# EAGLE design 40h_thru (EAGLE 4.15)
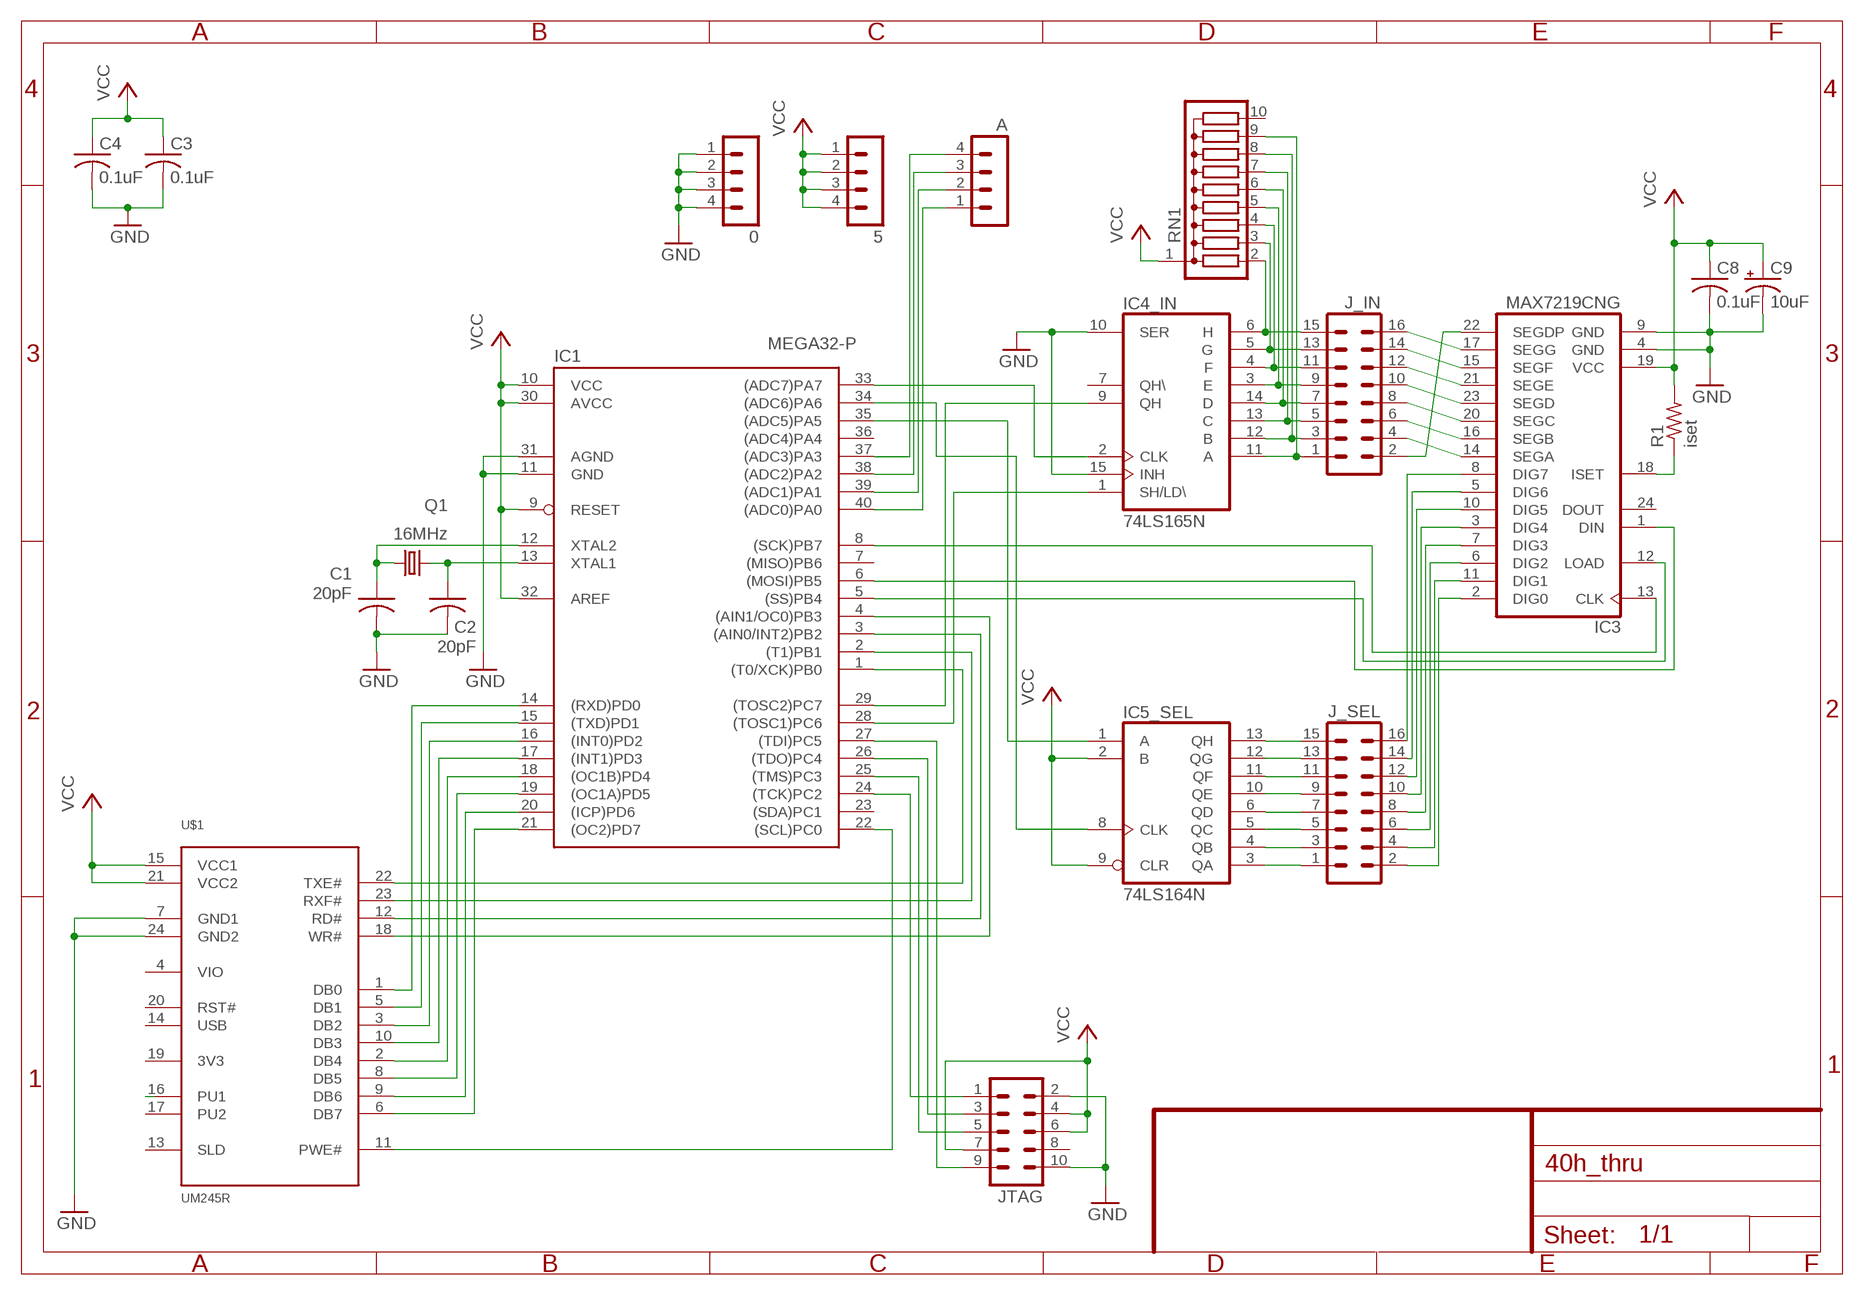
[diagram p0: schematic, sheet 1]

## Parts
0  MA04-1  [MA04-1]
5  MA04-1  [MA04-1]
A  MA04-1  [MA04-1]
C1  20pF  C-US050-025X075  [C050-025X075]
C2  20pF  C-US050-025X075  [C050-025X075]
C3  0.1uF  C-US050-025X075  [C050-025X075]
C4  0.1uF  C-US050-025X075  [C050-025X075]
C8  0.1uF  C-US050-025X075  [C050-025X075]
C9  10uF  CPOL-USTT2D4  [TT2D4]
IC1  MEGA32-P  [DIL40]
IC3  MAX7219CNG  [DIL24-3]
IC4_IN  74LS165N  [DIL16]
IC5_SEL  74LS164N  [DIL14]
J_IN  MA08-2  [MA08-2]
J_SEL  MA08-2  [MA08-2]
JTAG  MA05-2  [MA05-2]
Q1  16MHz  CRYTALHC49S  [HC49/S]
R1  iset  R-US_0207/7  [0207/7]
RN1  G09R  [SIL10]
U$1  UM245R  [DIL24]

## Nets
GND: 0.1 0.2 0.3 0.4 C1.2 C2.2 C3.2 C4.2 C8.2 C9.- IC1.11(GND) IC1.31(AGND) IC3.4(GND) IC3.9(GND) IC4_IN.10(SER) IC4_IN.15(INH) JTAG.2 JTAG.10 U$1.7(GND1) U$1.24(GND2)
MOSI: IC1.6((MOSI)PB5) IC3.1(DIN)
N$1: IC1.14((RXD)PD0) U$1.1(DB0)
N$2: C1.1 IC1.12(XTAL2) Q1.1
N$3: C2.1 IC1.13(XTAL1) Q1.2
N$4: IC1.15((TXD)PD1) U$1.5(DB1)
N$5: IC1.16((INT0)PD2) U$1.3(DB2)
N$6: IC1.17((INT1)PD3) U$1.10(DB3)
N$7: IC1.18((OC1B)PD4) U$1.2(DB4)
N$8: IC1.19((OC1A)PD5) U$1.8(DB5)
N$9: IC4_IN.6(H) J_IN.15 RN1.2
N$10: IC4_IN.5(G) J_IN.13 RN1.3
N$11: IC4_IN.4(F) J_IN.11 RN1.4
N$12: IC4_IN.3(E) J_IN.9 RN1.5
N$13: IC4_IN.14(D) J_IN.7 RN1.6
N$14: IC4_IN.13(C) J_IN.5 RN1.7
N$15: IC4_IN.12(B) J_IN.3 RN1.8
N$16: IC4_IN.11(A) J_IN.1 RN1.9
N$17: IC5_SEL.13(QH) J_SEL.15
N$18: IC5_SEL.12(QG) J_SEL.13
N$19: IC5_SEL.11(QF) J_SEL.11
N$20: IC5_SEL.10(QE) J_SEL.9
N$21: IC5_SEL.6(QD) J_SEL.7
N$22: IC5_SEL.5(QC) J_SEL.5
N$23: IC5_SEL.4(QB) J_SEL.3
N$24: IC5_SEL.3(QA) J_SEL.1
N$25: IC3.14(SEGA) J_IN.4
N$26: IC3.16(SEGB) J_IN.6
N$27: IC3.20(SEGC) J_IN.8
N$28: IC3.23(SEGD) J_IN.10
N$29: IC3.21(SEGE) J_IN.12
N$30: IC3.15(SEGF) J_IN.14
N$31: IC3.17(SEGG) J_IN.16
N$32: IC3.22(SEGDP) J_IN.2
N$33: IC3.8(DIG7) J_SEL.16
N$34: IC3.5(DIG6) J_SEL.14
N$35: IC3.10(DIG5) J_SEL.12
N$36: IC3.3(DIG4) J_SEL.10
N$37: IC3.7(DIG3) J_SEL.8
N$38: IC3.6(DIG2) J_SEL.6
N$39: IC3.11(DIG1) J_SEL.4
N$40: IC3.2(DIG0) J_SEL.2
N$41: IC1.20((ICP)PD6) U$1.9(DB6)
N$42: IC1.21((OC2)PD7) U$1.6(DB7)
N$43: IC1.22((SCL)PC0) U$1.11(PWE#)
N$44: U$1.16(PU1)
N$45: IC1.27((TDI)PC5) JTAG.9
N$46: IC1.26((TDO)PC4) JTAG.3
N$47: IC1.25((TMS)PC3) JTAG.5
N$48: IC1.24((TCK)PC2) JTAG.1
N$50: IC1.1((T0/XCK)PB0) U$1.22(TXE#)
N$51: IC1.2((T1)PB1) U$1.23(RXF#)
N$52: IC1.3((AIN0/INT2)PB2) U$1.12(RD#)
N$53: IC1.4((AIN1/OC0)PB3) U$1.18(WR#)
N$54: A.4 IC1.37((ADC3)PA3)
N$55: A.3 IC1.38((ADC2)PA2)
N$56: A.2 IC1.39((ADC1)PA1)
N$57: A.1 IC1.40((ADC0)PA0)
N$61: IC1.34((ADC6)PA6) IC5_SEL.8(CLK)
N$62: IC1.28((TOSC1)PC6) IC4_IN.1(SH/LD\)
N$63: IC1.29((TOSC2)PC7) IC4_IN.9(QH)
N$65: IC1.35((ADC5)PA5) IC5_SEL.1(A)
N$67: IC3.18(ISET) R1.1
N$68: IC1.33((ADC7)PA7) IC4_IN.2(CLK)
SCK: IC1.8((SCK)PB7) IC3.13(CLK)
SS: IC1.5((SS)PB4) IC3.12(LOAD)
VCC: 5.1 5.2 5.3 5.4 C3.1 C4.1 C8.1 C9.+ IC1.9(RESET) IC1.10(VCC) IC1.30(AVCC) IC1.32(AREF) IC3.19(VCC) IC5_SEL.2(B) IC5_SEL.9(CLR) JTAG.4 JTAG.6 JTAG.7 R1.2 RN1.1 U$1.15(VCC1) U$1.21(VCC2)
Unconnected: IC1.7((MISO)PB6) IC1.23((SDA)PC1) IC1.36((ADC4)PA4) IC3.24(DOUT) IC4_IN.7(QH\) JTAG.8 RN1.10 U$1.14(USB) U$1.17(PU2) U$1.19(3V3) U$1.20(RST#)

## Power pins joined to a net without a drawn wire
GND: IC4_IN.8(GND) IC5_SEL.7(GND)
SLD: U$1.13(SLD)
VCC: IC4_IN.16(VCC) IC5_SEL.14(VCC)
VIO: U$1.4(VIO)

## Library data of the parts
0 5 A = con-lstb:MA04-1: PIN HEADER
C1-C4 C8 = rcl:C-US: CAPACITOR, American symbol
C9 = rcl:CPOL-US: POLARIZED CAPACITOR, American symbol
IC1 = monome:MEGA32-P: MICROCONTROLLER 32 Kbytes FLASH 2 Kbytes SRAM 1 Kbytes EEPROM USART 8-channel 10 bit ADC
IC3 = maxim:MAX7219CNG: LED DISPLAY DRIVER
IC4_IN = monome:74*165: 8-bit parallel load SHIFT REGISTER
IC5_SEL = monome:74*164: 8-bit parallel out SHIFT REGISTER
J_IN J_SEL = con-lstb:MA08-2: PIN HEADER
JTAG = con-lstb:MA05-2: PIN HEADER
Q1 = crystal:CRYTAL: CRYSTAL
R1 = rcl:R-US_: RESISTOR, American symbol
RN1 = resistor-sil:G09R: SIL RESISTOR
U$1 = monome:UM245R

## Board
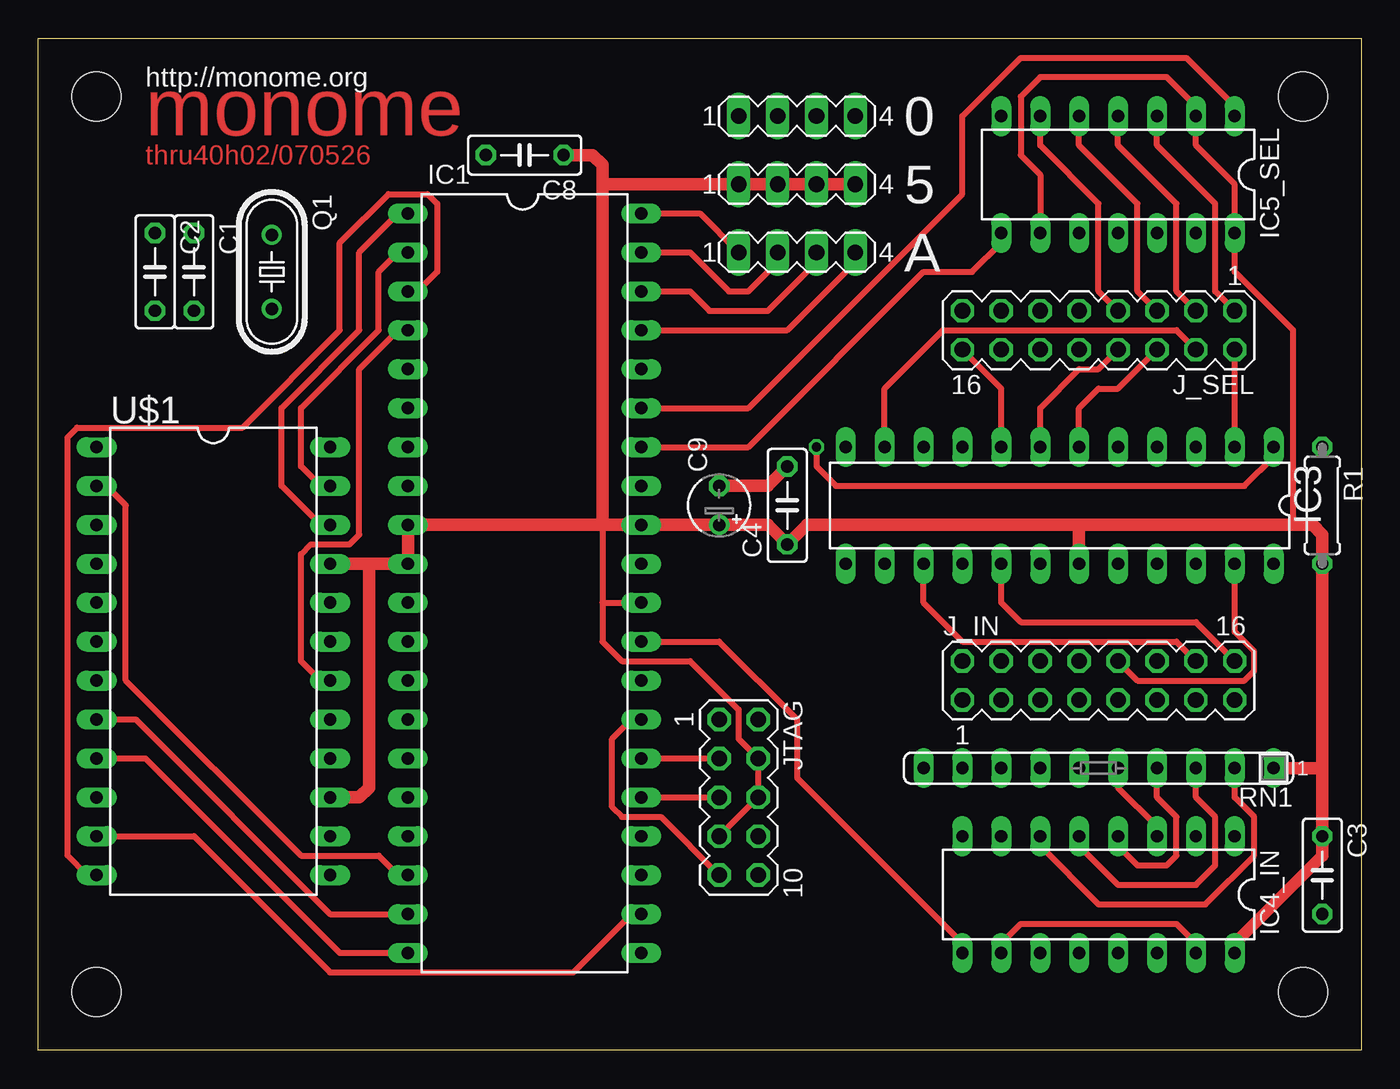
[diagram p1: board, top side]
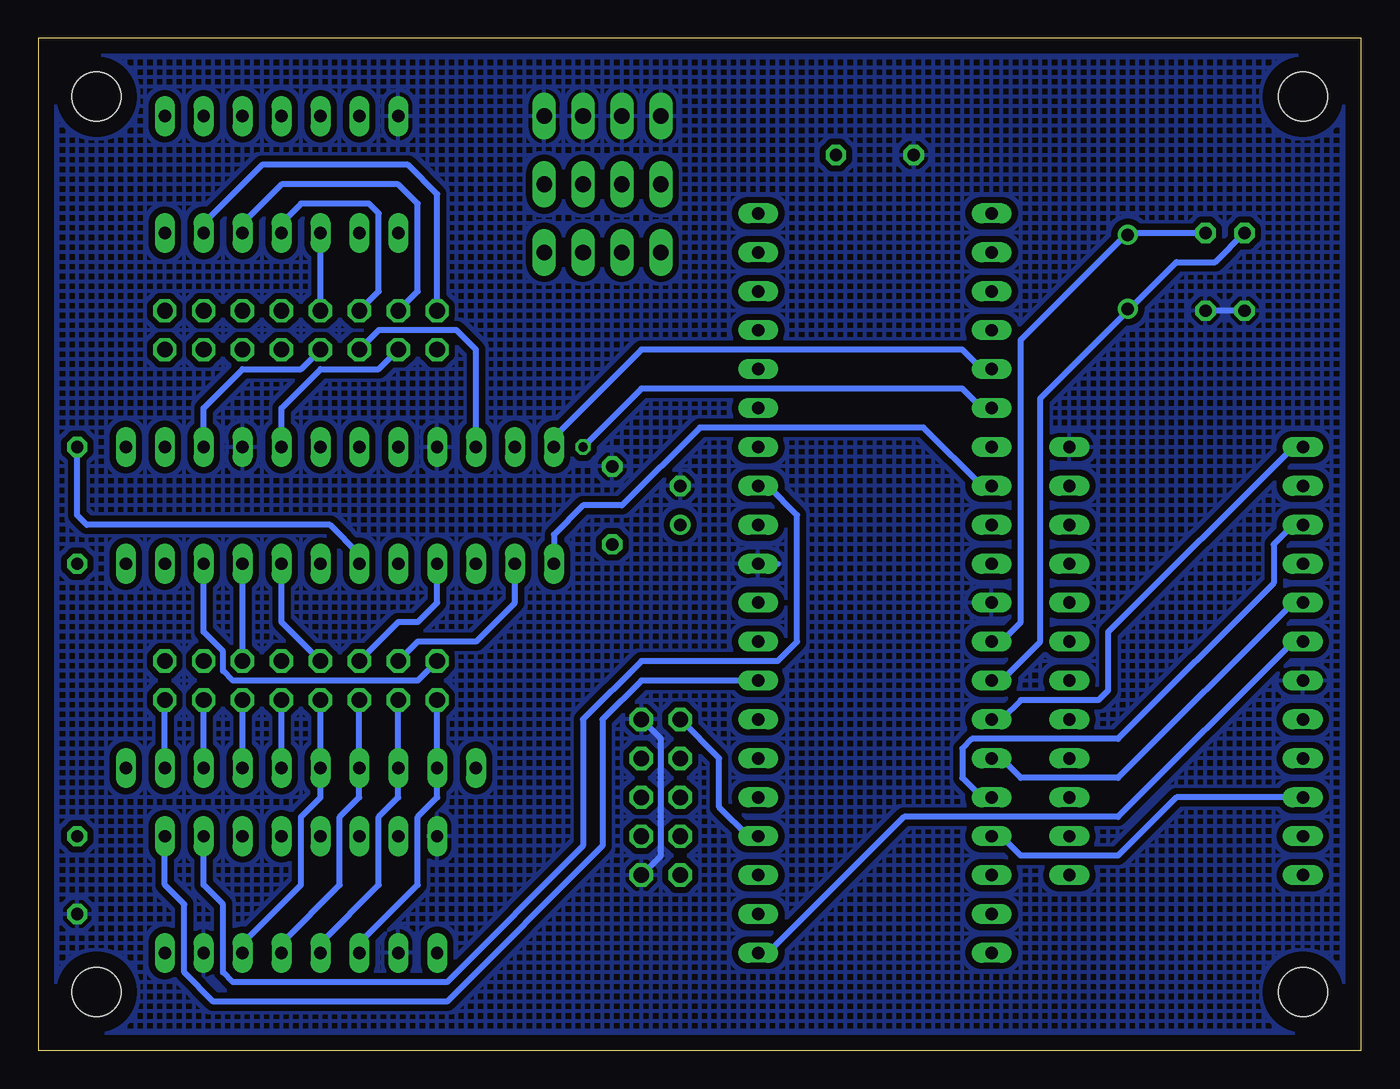
[diagram p2: board, bottom side, seen from below]

Size 86.36 x 66.04 mm. Coordinates in mm from the lower left corner, seen from the top.
Outline: 0,66.04 86.36,66.04 86.36,0 0,0 0,66.04
Copper layers (1*16): Top 0.035mm / dielectric 1.5mm / Bottom 0.035mm
Design rules "default": minimum track width 10mil, minimum drill 24mil, track to track 8mil, track to pad 8mil, pad to pad 8mil, via to via 8mil, smd to smd 8mil, copper to edge 40mil, drill to drill 8mil, minimum pad ring 10mil, minimum via ring 8mil, stop-mask expansion 4mil, vias tented up to drill 0mil, thermal gap 10mil
Holes 3.2 mm at 3.81,62.23 3.81,3.81 82.55,3.81 82.55,62.23

### Footprints (pad centres in the part's own frame; a part is rotated, then mirrored left to right if it is on the bottom)
MA04-1 = drill 1.016 long: 1 -3.81,0; 2 -1.27,0; 3 1.27,0; 4 3.81,0
C050-025X075 = drill 0.813 octagon: 1 -2.54,0; 2 2.54,0
TT2D4 = drill 0.813 round: + -1.27,0 | drill 0.813 octagon: - 1.27,0
DIL40 = drill 0.813 long: 1 -24.13,-7.62; 2 -21.59,-7.62; 3 -19.05,-7.62; 4 -16.51,-7.62; 5 -13.97,-7.62; 6 -11.43,-7.62; 7 -8.89,-7.62; 8 -6.35,-7.62; 9 -3.81,-7.62; 10 -1.27,-7.62; 11 1.27,-7.62; 12 3.81,-7.62; 13 6.35,-7.62; 14 8.89,-7.62; 15 11.43,-7.62; 16 13.97,-7.62; 17 16.51,-7.62; 18 19.05,-7.62; 19 21.59,-7.62; 20 24.13,-7.62; 21 24.13,7.62; 22 21.59,7.62; 23 19.05,7.62; 24 16.51,7.62; 25 13.97,7.62; 26 11.43,7.62; 27 8.89,7.62; 28 6.35,7.62; 29 3.81,7.62; 30 1.27,7.62; 31 -1.27,7.62; 32 -3.81,7.62; 33 -6.35,7.62; 34 -8.89,7.62; 35 -11.43,7.62; 36 -13.97,7.62; 37 -16.51,7.62; 38 -19.05,7.62; 39 -21.59,7.62; 40 -24.13,7.62
DIL24-3 = drill 0.813 long: 1 -13.97,-3.81; 2 -11.43,-3.81; 3 -8.89,-3.81; 4 -6.35,-3.81; 5 -3.81,-3.81; 6 -1.27,-3.81; 7 1.27,-3.81; 8 3.81,-3.81; 9 6.35,-3.81; 10 8.89,-3.81; 11 11.43,-3.81; 12 13.97,-3.81; 13 13.97,3.81; 14 11.43,3.81; 15 8.89,3.81; 16 6.35,3.81; 17 3.81,3.81; 18 1.27,3.81; 19 -1.27,3.81; 20 -3.81,3.81; 21 -6.35,3.81; 22 -8.89,3.81; 23 -11.43,3.81; 24 -13.97,3.81
DIL16 = drill 0.813 long: 1 -8.89,-3.81; 2 -6.35,-3.81; 3 -3.81,-3.81; 4 -1.27,-3.81; 5 1.27,-3.81; 6 3.81,-3.81; 7 6.35,-3.81; 8 8.89,-3.81; 9 8.89,3.81; 10 6.35,3.81; 11 3.81,3.81; 12 1.27,3.81; 13 -1.27,3.81; 14 -3.81,3.81; 15 -6.35,3.81; 16 -8.89,3.81
DIL14 = drill 0.813 long: 1 -7.62,-3.81; 2 -5.08,-3.81; 3 -2.54,-3.81; 4 0,-3.81; 5 2.54,-3.81; 6 5.08,-3.81; 7 7.62,-3.81; 8 7.62,3.81; 9 5.08,3.81; 10 2.54,3.81; 11 0,3.81; 12 -2.54,3.81; 13 -5.08,3.81; 14 -7.62,3.81
MA08-2 = drill 1.016 octagon: 1 -8.89,-1.27; 2 -8.89,1.27; 3 -6.35,-1.27; 4 -6.35,1.27; 5 -3.81,-1.27; 6 -3.81,1.27; 7 -1.27,-1.27; 8 -1.27,1.27; 9 1.27,-1.27; 10 1.27,1.27; 11 3.81,-1.27; 12 3.81,1.27; 13 6.35,-1.27; 14 6.35,1.27; 15 8.89,-1.27; 16 8.89,1.27
MA05-2 = drill 1.016 octagon: 1 -5.08,-1.27; 2 -5.08,1.27; 3 -2.54,-1.27; 4 -2.54,1.27; 5 0,-1.27; 6 0,1.27; 7 2.54,-1.27; 8 2.54,1.27; 9 5.08,-1.27; 10 5.08,1.27
HC49/S = drill 0.813 round: 1 -2.413,0; 2 2.413,0
0207/7 = drill 0.813 octagon: 1 -3.81,0; 2 3.81,0
SIL10 = drill 0.813 long: 1 -11.43,0; 2 -8.89,0; 3 -6.35,0; 4 -3.81,0; 5 -1.27,0; 6 1.27,0; 7 3.81,0; 8 6.35,0; 9 8.89,0; 10 11.43,0
DIL24 = drill 0.813 long: 1 -13.97,-7.62; 2 -11.43,-7.62; 3 -8.89,-7.62; 4 -6.35,-7.62; 5 -3.81,-7.62; 6 -1.27,-7.62; 7 1.27,-7.62; 8 3.81,-7.62; 9 6.35,-7.62; 10 8.89,-7.62; 11 11.43,-7.62; 12 13.97,-7.62; 13 13.97,7.62; 14 11.43,7.62; 15 8.89,7.62; 16 6.35,7.62; 17 3.81,7.62; 18 1.27,7.62; 19 -1.27,7.62; 20 -3.81,7.62; 21 -6.35,7.62; 22 -8.89,7.62; 23 -11.43,7.62; 24 -13.97,7.62

### Placement (x,y rotation side)
0  49.53,60.96 0 top
5  49.53,56.52 0 top
A  49.53,52.07 0 top
C1  10.16,50.8 270 top
C2  7.62,50.8 270 top
C3  83.82,11.43 270 top
C4  48.9,35.56 90 top
C8  31.75,58.42 180 top
C9  44.45,35.56 90 top
IC1  31.75,30.48 270 top
IC3  66.67,35.56 180 top
IC4_IN  69.22,10.16 180 top
IC5_SEL  70.48,57.15 180 top
J_IN  69.22,24.13 0 top
J_SEL  69.22,46.99 180 top
JTAG  45.72,16.51 270 top
Q1  15.24,50.8 270 top
R1  83.82,35.56 270 top
RN1  69.22,18.41 180 top
U$1  11.43,25.4 270 top

### Tracks (layer width: path | path; a pad name or v marks a point on that pad's centre or on a via)
GND
  Top 0.406: IC4_IN.10 62.87,6.99 64.14,8.26 74.3,8.26 75.56,6.99 IC4_IN.15
  Top 0.813: C9.- 47.62,36.83 C4.2
  Bottom 0.406: C2.2 C1.2 | JTAG.10 45.72,12.7 45.72,20.32 JTAG.2 | IC1.31 38.1,31.75
  pour Bottom (isolate 0.406, hatched): 0,66.04 0,0 86.36,0 86.36,66.04
MOSI  (via drill 0.6)
  Top 0.406: IC3.1 80.64,38.73 78.74,36.83 52.07,36.83 50.8,38.1 v50.8,39.37
  Bottom 0.406: v50.8,39.37 46.99,43.18 26.04,43.18 24.77,41.91 IC1.6
N$1
  Bottom 0.406: IC1.14 23.5,21.59 22.23,22.86 17.14,22.86 16.51,23.5 16.51,27.3 4.45,39.37 U$1.1
N$2
  Bottom 0.406: IC1.12 23.5,26.67 22.23,27.94 22.23,46.35 15.37,53.21 Q1.1 15.11,53.34 C1.1
N$3
  Bottom 0.406: IC1.13 23.5,24.13 20.95,26.67 20.95,42.55 15.24,48.26 Q1.2 15.11,48.39 12.06,51.44 9.53,51.44 C2.1
N$4
  Bottom 0.406: IC1.15 23.5,19.05 22.23,17.78 15.88,17.78 4.45,29.21 U$1.5
N$5
  Bottom 0.406: IC1.16 24.77,16.51 26.04,17.78 26.04,19.68 25.4,20.32 15.88,20.32 5.71,30.48 5.71,33.02 4.45,34.29 U$1.3
N$6
  Bottom 0.406: U$1.10 12.06,16.51 15.88,12.7 22.23,12.7 23.5,13.97 IC1.17
N$7
  Top 0.406: IC1.18 23.5,11.43 22.23,12.7 17.14,12.7 5.71,24.13 5.71,35.56 4.45,36.83 U$1.2
N$8
  Top 0.406: IC1.19 19.05,8.89 6.35,21.59 U$1.8
N$9
  Top 0.406: IC4_IN.6 65.41,13.34 69.22,9.53 76.2,9.53 79.38,12.7 79.38,15.24 78.11,16.51 RN1.2
  Bottom 0.406: RN1.2 J_IN.15
N$10
  Top 0.406: RN1.3 75.56,16.51 76.83,15.24 76.83,12.06 75.56,10.79 70.48,10.79 67.94,13.34 IC4_IN.5
  Bottom 0.406: RN1.3 J_IN.13
N$11
  Top 0.406: IC4_IN.4 70.48,13.34 71.75,12.06 73.66,12.06 74.3,12.7 74.3,15.24 73.03,16.51 RN1.4
  Bottom 0.406: RN1.4 J_IN.11
N$12
  Top 0.406: IC4_IN.3 73.03,14.61 70.48,17.14 RN1.5
  Bottom 0.406: RN1.5 J_IN.9
N$13
  Bottom 0.406: IC4_IN.14 73.03,6.99 69.22,10.79 69.22,15.24 67.94,16.51 RN1.6 J_IN.7
N$14
  Bottom 0.406: IC4_IN.13 70.48,6.99 66.67,10.79 66.67,15.24 65.41,16.51 RN1.7 J_IN.5
N$15
  Bottom 0.406: IC4_IN.12 67.94,6.99 64.14,10.79 64.14,15.24 62.87,16.51 RN1.8 J_IN.3
N$16
  Bottom 0.406: IC4_IN.11 65.41,6.99 61.59,10.79 61.59,15.24 60.33,16.51 RN1.9 J_IN.1
N$17
  Bottom 0.406: IC5_SEL.13 75.56,53.98 71.75,57.78 62.23,57.78 60.33,55.88 J_SEL.15
N$18
  Bottom 0.406: IC5_SEL.12 73.03,53.98 70.48,56.52 62.87,56.52 61.59,55.24 61.59,49.53 J_SEL.13
N$19
  Bottom 0.406: IC5_SEL.11 70.48,53.98 69.22,55.24 64.77,55.24 64.14,54.61 64.14,49.53 J_SEL.11
N$20
  Bottom 0.406: J_SEL.9 IC5_SEL.10
N$21
  Top 0.406: IC5_SEL.6 65.41,59.05 69.22,55.24 69.22,49.53 J_SEL.7
N$22
  Top 0.406: IC5_SEL.5 67.94,59.05 71.75,55.24 71.75,49.53 J_SEL.5
N$23
  Top 0.406: IC5_SEL.4 70.48,59.05 74.3,55.24 74.3,49.53 J_SEL.3
N$24
  Top 0.406: IC5_SEL.3 73.03,59.05 76.83,55.24 76.83,49.53 J_SEL.1
N$25
  Bottom 0.406: IC3.14 55.24,29.21 57.78,26.67 61.59,26.67 J_IN.4
N$26
  Bottom 0.406: IC3.16 60.33,29.21 61.59,27.94 62.87,27.94 J_IN.6
N$27
  Bottom 0.406: IC3.20 70.48,27.94 J_IN.8
N$28
  Top 0.406: J_IN.10 71.75,24.13 78.74,24.13 79.38,24.77 79.38,26.04 78.11,27.3 IC3.23
N$29
  Bottom 0.406: J_IN.12 IC3.21
N$30
  Top 0.406: IC3.15 57.78,29.21 60.33,26.67 74.3,26.67 J_IN.14
N$31
  Top 0.406: J_IN.16 75.56,27.94 64.14,27.94 62.87,29.21 IC3.17
N$32
  Bottom 0.406: J_IN.2 61.59,24.13 73.66,24.13 74.3,24.77 74.3,26.04 75.56,27.3 IC3.22
N$33
  Top 0.406: J_SEL.16 62.87,43.18 IC3.8
N$34
  Bottom 0.406: IC3.5 70.48,41.91 67.94,44.45 64.14,44.45 J_SEL.14
N$35
  Bottom 0.406: J_SEL.12 64.14,46.99 59.05,46.99 57.78,45.72 IC3.10
N$36
  Bottom 0.406: J_SEL.10 69.22,44.45 73.03,44.45 75.56,41.91 IC3.3
N$37
  Top 0.406: IC3.7 65.41,41.91 67.94,44.45 69.22,44.45 J_SEL.8
N$38
  Top 0.406: IC3.6 67.94,41.91 69.22,43.18 70.48,43.18 J_SEL.6
N$39
  Top 0.406: J_SEL.4 74.3,46.99 59.05,46.99 55.24,43.18 IC3.11
N$40
  Top 0.406: IC3.2 J_SEL.2
N$41
  Top 0.406: U$1.9 6.99,19.05 19.68,6.35 IC1.20
N$42
  Bottom 0.406: U$1.6 4.45,26.67 15.88,15.24 29.84,15.24 38.73,6.35 IC1.21
N$43
  Top 0.406: U$1.11 10.16,13.97 19.05,5.08 34.92,5.08 38.73,8.89 IC1.22
N$45
  Top 0.406: IC1.27 38.73,21.59 37.47,20.32 37.47,15.88 38.1,15.24 40.64,15.24 JTAG.9
N$46
  Top 0.406: IC1.26 JTAG.3
N$47
  Top 0.406: IC1.25 JTAG.5
N$48
  Bottom 0.406: JTAG.1 41.91,19.05 41.91,15.88 40.01,13.97 IC1.24
N$50
  Top 0.406: IC1.1 23.5,54.61 20.95,52.07 20.95,46.99 15.88,41.91 15.88,36.83 18.41,34.29 U$1.22
N$51
  Top 0.406: IC1.2 23.5,52.07 22.23,50.8 22.23,46.99 17.14,41.91 17.14,38.1 18.41,36.83 U$1.23
N$52
  Top 0.406: U$1.12 3.17,11.43 1.91,12.7 1.91,40.01 2.54,40.64 13.34,40.64 19.68,46.99 19.68,52.7 22.86,55.88 25.4,55.88 26.04,55.24 26.04,50.8 24.77,49.53 IC1.3
N$53
  Top 0.406: U$1.18 18.41,24.13 17.14,25.4 17.14,32.38 17.78,33.02 20.32,33.02 20.95,33.66 20.95,44.45 23.5,46.99 IC1.4
N$54
  Top 0.406: A.4 53.34,51.44 48.9,46.99 IC1.37
N$55
  Top 0.406: A.3 50.8,51.44 47.62,48.26 43.81,48.26 42.55,49.53 IC1.38
N$56
  Top 0.406: IC1.39 42.55,52.07 45.09,49.53 46.35,49.53 48.26,51.44 A.2
N$57
  Top 0.406: IC1.40 43.18,54.61 A.1
N$61
  Top 0.406: IC5_SEL.8 62.87,52.7 60.96,50.8 57.78,50.8 46.35,39.37 IC1.34
N$62
  Bottom 0.406: IC4_IN.1 78.11,10.79 76.83,9.53 76.83,5.08 74.93,3.17 59.69,3.17 49.53,13.34 49.53,21.59 46.99,24.13 IC1.28
N$63
  Top 0.406: IC4_IN.9 60.33,6.99 49.53,17.78 49.53,21.59 44.45,26.67 IC1.29
N$65
  Top 0.406: IC5_SEL.1 78.11,61.59 74.93,64.77 64.14,64.77 60.33,60.96 60.33,55.88 46.35,41.91 IC1.35
N$67
  Bottom 0.406: IC3.18 65.41,32.38 67.31,34.29 83.19,34.29 83.82,34.92 R1.1
N$68
  Bottom 0.406: IC4_IN.2 75.56,10.79 74.3,9.53 74.3,5.08 73.66,4.45 59.69,4.45 50.8,13.34 50.8,21.59 46.99,25.4 38.1,25.4 36.83,26.67 36.83,34.92 38.73,36.83 IC1.33
SCK
  Bottom 0.406: IC3.13 52.7,33.66 50.8,35.56 48.26,35.56 43.18,40.64 28.57,40.64 24.77,36.83 IC1.8
SS
  Bottom 0.406: IC3.12 52.7,40.01 46.99,45.72 26.04,45.72 24.77,44.45 IC1.5
VCC
  Top 0.406: IC5_SEL.9 65.41,57.15 64.14,58.42 64.14,62.23 65.41,63.5 73.66,63.5 75.56,61.59 IC5_SEL.2 75.56,59.05 78.11,56.52 IC5_SEL.14 78.11,50.8 81.92,46.99 81.92,34.29 | JTAG.7 JTAG.6 JTAG.4 45.72,20.32 45.72,22.23 42.55,25.4 38.1,25.4 36.83,26.67 36.83,29.21 | 36.83,29.21 IC1.30 | 36.83,34.29 36.83,29.21
  Top 0.813: IC4_IN.16 78.11,6.99 83.82,12.7 C3.1 83.82,18.41 | 67.94,34.29 IC3.19 | 67.94,34.29 81.92,34.29 83.19,34.29 83.82,33.66 R1.2 83.82,18.41 | 67.94,34.29 50.16,34.29 C4.1 47.62,34.29 C9.+ IC1.32 36.83,34.29 | 5.4 5.3 5.2 5.1 36.83,56.52 | 21.59,31.75 U$1.21 | 21.59,31.75 IC1.10 IC1.9 36.83,34.29 | 36.83,56.52 36.83,57.78 36.2,58.42 C8.1 | 36.83,34.29 36.83,56.52 | 83.82,18.41 RN1.1 | U$1.15 20.95,16.51 21.59,17.14 21.59,31.75

### Text on the board
Top: monome | thru40h02/070526
tPlace: http://monome.org